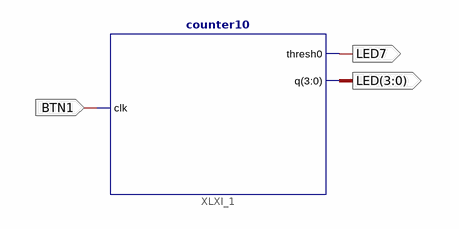
[diagram p0: schematic sheet 1]
// Xilinx ISE schematic main.sch (spartan6) as structural Verilog: 1 symbols, 3 ports
module main (
  input  BTN1,
  output LED7,
  output [3:0] LED
);

  counter10 XLXI_1 (.clk(BTN1), .thresh0(LED7), .q(LED));
endmodule
